# EAGLE schematic pcbdesign (EAGLE 9.3.1)
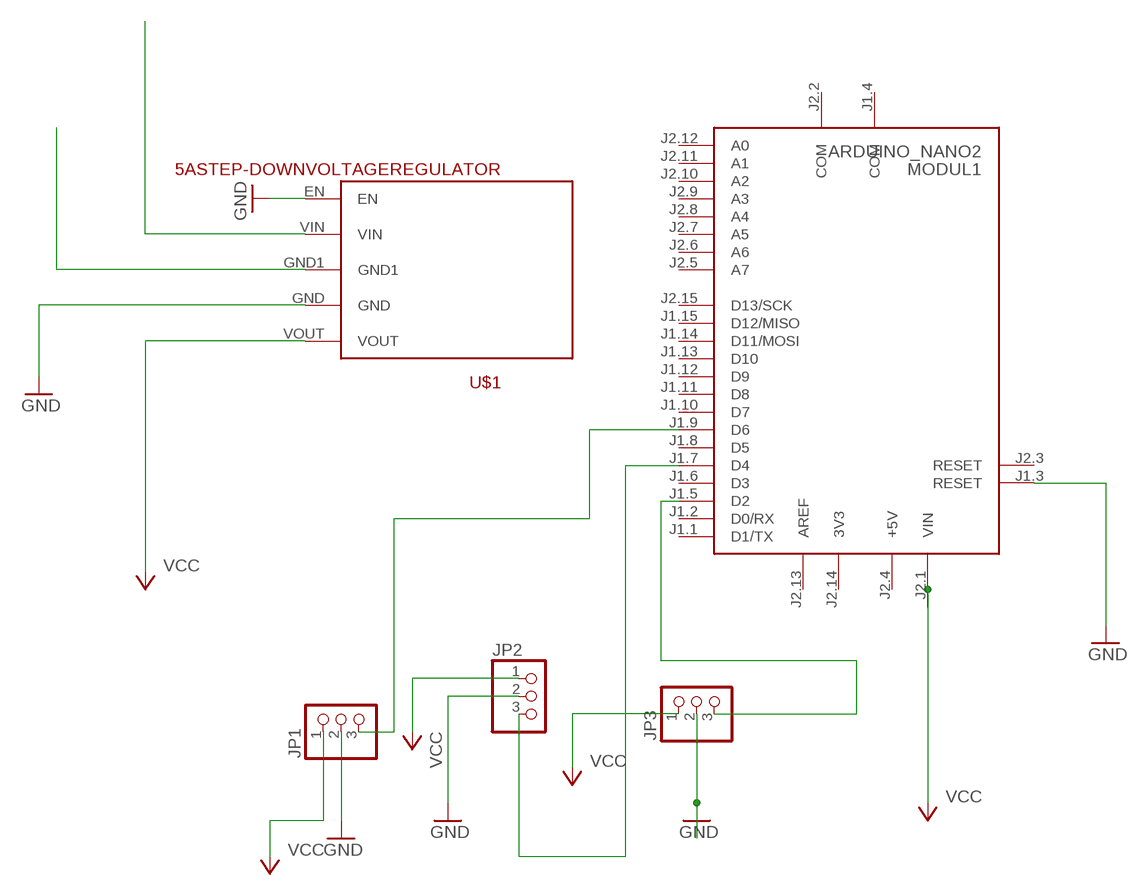
[diagram p0: schematic, sheet 1]

## Parts
JP1  PINHD-1X3  [1X03]
JP2  PINHD-1X3  [1X03]
JP3  PINHD-1X3  [1X03]
MODUL1  ARDUINO_NANO2  [ARDUINO_NANO2]
U$1  5ASTEP-DOWNVOLTAGEREGULATOR  [REG15D]

## Nets
GND: JP1.2 JP2.2 JP3.2 MODUL1.J1.3(RESET) U$1.EN U$1.GND
N$1: JP1.3 MODUL1.J1.9(D6)
N$2: JP2.3 MODUL1.J1.7(D4)
N$3: JP3.3 MODUL1.J1.5(D2)
N$4: U$1.VIN
N$5: U$1.GND1
VCC: JP1.1 JP2.1 JP3.1 MODUL1.J2.1(VIN) U$1.VOUT
Unconnected: MODUL1.J1.1(D1/TX) MODUL1.J1.2(D0/RX) MODUL1.J1.6(D3) MODUL1.J1.8(D5) MODUL1.J1.10(D7) MODUL1.J1.11(D8) MODUL1.J1.12(D9) MODUL1.J1.13(D10) MODUL1.J1.14(D11/MOSI) MODUL1.J1.15(D12/MISO) MODUL1.J2.3(RESET) MODUL1.J2.5(A7) MODUL1.J2.6(A6) MODUL1.J2.7(A5) MODUL1.J2.8(A4) MODUL1.J2.9(A3) MODUL1.J2.10(A2) MODUL1.J2.11(A1) MODUL1.J2.12(A0) MODUL1.J2.15(D13/SCK)

## Power pins joined to a net without a drawn wire
3V3: MODUL1.J2.14(3V3)
+5V: MODUL1.J2.4(+5V)
AREF: MODUL1.J2.13(AREF)
COM: MODUL1.J1.4(COM) MODUL1.J2.2(COM)

## Library data of the parts
JP1-JP3 = adafruit:PINHD-1X3: PIN HEADER
MODUL1 = arduino:ARDUINO_NANO2: Arduino Nano2 Auto generated by modulcreator.ulp \;; ANZAHL: 2; MODUL: TRUE; STECKX0: -76200; STECKX1: 76200; STECKY0: 177800; STECKY1: 177800
U$1 = oddWorld:5ASTEP-DOWNVOLTAGEREGULATOR